# Altium schematic sheet SW6124+A+B+C+内部解密Lighting+LED.SchDoc
size A2; SheetNumber: 0; SheetTotal: 0
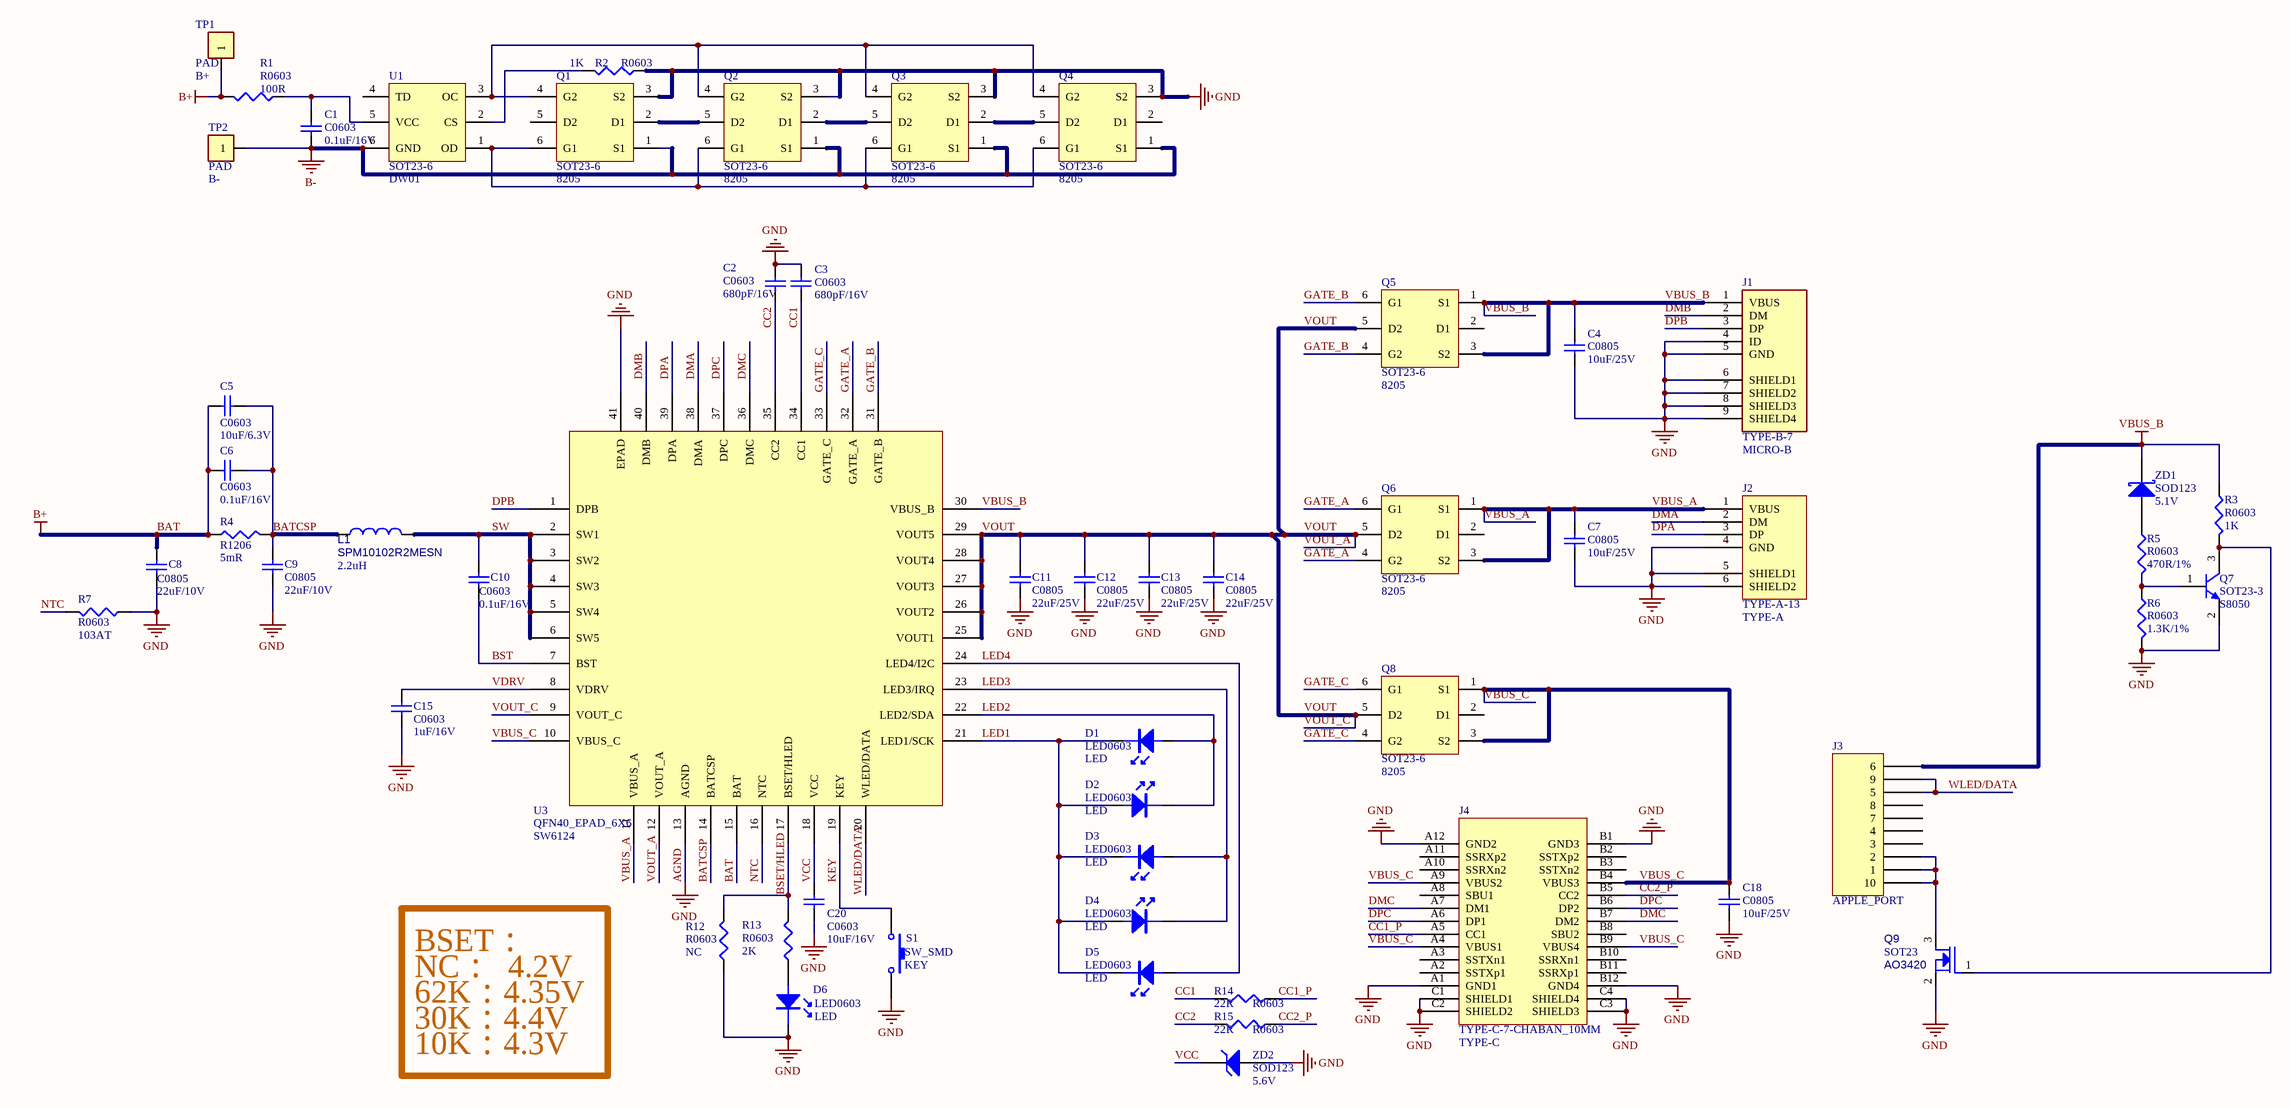
[diagram p0: SW6124+A+B+C+内部解密Lighting+LED.SchDoc]

## Parts
C1  C0603  value 0.1uF/16V  [C0603]
C2  C0603  value 680pF/16V  [C0603]
C3  C0603  value 680pF/16V  [C0603]
C4  C0805  value 10uF/25V  [C0805]
C5  C0603  value 10uF/6.3V  [C0603]
C6  C0603  value 0.1uF/16V  [C0603]
C7  C0805  value 10uF/25V  [C0805]
C8  C0805  value 22uF/10V  [C0805]
C9  C0805  value 22uF/10V  [C0805]
C10  C0603  value 0.1uF/16V  [C0603]
C11  C0805  value 22uF/25V  [C0805]
C12  C0805  value 22uF/25V  [C0805]
C13  C0805  value 22uF/25V  [C0805]
C14  C0805  value 22uF/25V  [C0805]
C15  C0603  value 1uF/16V  [C0603]
C18  C0805  value 10uF/25V  [C0805]
C20  C0603  value 10uF/16V  [C0603]
D1  LED  [LED0603]
D2  LED  [LED0603]
D3  LED  [LED0603]
D4  LED  [LED0603]
D5  LED  [LED0603]
D6  LED  [LED0603]
J1  value MICRO-B  [TYPE-B-7]  (hidden comment: USB_MICRO_B)
J2  value TYPE-A  [TYPE-A-13]  (hidden comment: TYPE-A-1)
J3  APPLE_PORT
J4  TYPE-C  [TYPE-C-7-CHABAN_10MM]
L1  SPM10102R2MESN  value 2.2uH  [INDUCTOR_SPM1010]
Q1  8205  [SOT23-6]
Q2  8205  [SOT23-6]
Q3  8205  [SOT23-6]
Q4  8205  [SOT23-6]
Q5  8205  [SOT23-6]
Q6  8205  [SOT23-6]
Q7  Footprint: SOT23-3  [SOT-23-]  (hidden comment: S8050)
Q8  8205  [SOT23-6]
Q9  AO3420  [SOT23]
R1  R0603  value 100R  [R0603]
R2  R0603  value 1K  [R0603]
R3  R0603  value 1K  [R0603]
R4  R1206  value 5mR  [R1206]
R5  R0603  value 470R/1%  [R0603]
R6  R0603  value 1.3K/1%  [R0603]
R7  R0603  value 103AT  [R0603]
R12  R0603  value NC  [R0603]
R13  R0603  value 2K  [R0603]
R14  R0603  value 22R  [R0603]
R15  R0603  value 22R  [R0603]
S1  KEY  [SW_SMD]
TP1  B+  [PAD]
TP2  B-  [PAD]
U1  DW01  [SOT23-6]
U3  Footprint: QFN40_EPAD_6X6  (hidden comment: SW6124)
ZD1  value 5.1V  Footprint: SOD123  (hidden comment: Diode 11DQ03)
ZD2  SOD123  [SOD-123]

## Nets
AGND: C2.2 C3.2 C4.1 C7.1 C8.1 C9.1 C11.1 C12.1 C13.1 C14.1 C15.1 C18.1 C20.1 D6.2(K) J1.4(ID) J1.5(GND) J1.6(SHIELD1) J1.7(SHIELD2) J1.8(SHIELD3) J1.9(SHIELD4) J2.4(GND) J2.5(SHIELD1) J2.6(SHIELD2) J4.A1(GND1) J4.A12(GND2) J4.B1(GND3) J4.B12(GND4) J4.C1(SHIELD1) J4.C2(SHIELD2) J4.C3(SHIELD3) J4.C4(SHIELD4) Q1.3(S2) Q2.3(S2) Q3.3(S2) Q4.3(S2) Q7.2(E) Q9.2(SOURCE) R2.1 R6.2 R7.1 R12.1 S1.2 U3.13(AGND) U3.41(EPAD) ZD2.1(A)  [also labelled GND]
B-: C1.1 Q1.1(S1) Q2.1(S1) Q3.1(S1) Q4.1(S1) TP2.1 U1.6(GND)
BAT: C5.1 C6.1 C8.2 R1.2 R4.1 TP1.1 U3.15(BAT)  [also labelled B+]
VBUS_B: C4.2 J1.1(VBUS) J3.6 Q5.1(S1) Q5.3(S2) R3.1 U3.30(VBUS_B) ZD1.2(K)
BATCSP: C5.2 C6.2 C9.2 L1.1 R4.2 U3.14(BATCSP)
BSET/HLED: R12.2 R13.2 U3.17(BSET/HLED)
BST: C10.1 U3.7(BST)
CC1: C3.1 R14.2 U3.34(CC1)
CC1_P: J4.A5(CC1) R14.1
CC2: C2.1 R15.2 U3.35(CC2)
CC2_P: J4.B5(CC2) R15.1
DMA: J2.2(DM) U3.38(DMA)
DMB: J1.2(DM) U3.40(DMB)
DMC: J4.A7(DM1) J4.B7(DM2) U3.36(DMC)
DPA: J2.3(DP) U3.39(DPA)
DPB: J1.3(DP) U3.1(DPB)
DPC: J4.A6(DP1) J4.B6(DP2) U3.37(DPC)
GATE_A: Q6.4(G2) Q6.6(G1) U3.32(GATE_A)
GATE_B: Q5.4(G2) Q5.6(G1) U3.31(GATE_B)
GATE_C: Q8.4(G2) Q8.6(G1) U3.33(GATE_C)
KEY: S1.1 U3.19(KEY)
LED1: D1.2(K) D2.1(A) D3.2(K) D4.1(A) D5.2(K) U3.21(LED1/SCK)
LED2: D1.1(A) D2.2(K) U3.22(LED2/SDA)
LED3: D3.1(A) D4.2(K) U3.23(LED3/IRQ)
LED4: D5.1(A) U3.24(LED4/I2C)
NTC: R7.2 U3.16(NTC)
SW: C10.2 L1.2 U3.2(SW1) U3.3(SW2) U3.4(SW3) U3.5(SW4) U3.6(SW5)
VBUS_A: C7.2 J2.1(VBUS) Q6.1(S1) Q6.3(S2) U3.11(VBUS_A)
VBUS_C: C18.2 J4.A4(VBUS1) J4.A9(VBUS2) J4.B4(VBUS3) J4.B9(VBUS4) Q8.1(S1) Q8.3(S2) U3.10(VBUS_C)
VCC: C20.2 U3.18(VCC) ZD2.2(K)
VDRV: C15.2 U3.8(VDRV)
VOUT: C11.2 C12.2 C13.2 C14.2 Q5.5(D2) Q6.5(D2) Q8.5(D2) U3.9(VOUT_C) U3.12(VOUT_A) U3.25(VOUT1) U3.26(VOUT2) U3.27(VOUT3) U3.28(VOUT4) U3.29(VOUT5)  [also labelled VOUT_A, VOUT_C]
WLED/DATA: J3.5 J3.9 U3.20(WLED/DATA)
NetC1_2: C1.2 R1.1 U1.5(VCC)
NetD6_1: D6.1(A) R13.1
NetJ3_1: J3.1 J3.2 J3.10 Q9.3(DRAIN)
NetQ1_2: Q1.2(D1) Q2.5(D2)
NetQ1_4: Q1.4(G2) Q2.4(G2) Q3.4(G2) Q4.4(G2) U1.3(OC)
NetQ1_6: Q1.6(G1) Q2.6(G1) Q3.6(G1) Q4.6(G1) U1.1(OD)
NetQ2_2: Q2.2(D1) Q3.5(D2)
NetQ3_2: Q3.2(D1) Q4.5(D2)
NetQ7_1: Q7.1(B) R5.2 R6.1
NetQ7_3: Q7.3(C) Q9.1(GATE) R3.2
NetR2_2: R2.2 U1.2(CS)
NetR5_1: R5.1 ZD1.1(A)

Not connected (* = marked no-connect by the designer): J3 3 4 7 8; J4 A2(SSTXp1) A3(SSTXn1) A8(SBU1) A10(SSRXn2) A11(SSRXp2) B2(SSTXp2) B3(SSTXn2) B8(SBU2) B10(SSRXn1) B11(SSRXp1); Q1 5(D2); Q4 2(D1); Q5 2(D1); Q6 2(D1); Q8 2(D1); U1 4(TD)

## Notes on the sheet
- BSET：
- NC：  4.2V
- 62K：4.35V
- 30K：4.4V
- 10K：4.3V
- (in symbol D Zener) 5.6V

## Library data of the parts
C1 = Cap: Capacitor; Published: 8-Jun-2000; LatestRevisionDate: 17-Jul-2002; LatestRevisionNote: Re-released for DXP Platform.; PackageReference: RAD-0.3; Publisher: Altium Limited; PackageDescription: Radial Cap, Thru-Hole; 2 Leads; 0.3 in Pin Spacing
C2-C7 C10 C15 C18 C20 = CAP0603: Capacitor; Published: 8-Jun-2000; LatestRevisionDate: 17-Jul-2002; LatestRevisionNote: Re-released for DXP Platform.; PackageReference: RAD-0.3; Publisher: Altium Limited; PackageDescription: Radial Cap, Thru-Hole; 2 Leads; 0.3 in Pin Spacing
C8 C9 C11-C14 = CAP0805: Capacitor; Published: 8-Jun-2000; LatestRevisionDate: 17-Jul-2002; LatestRevisionNote: Re-released for DXP Platform.; PackageReference: RAD-0.3; Publisher: Altium Limited; PackageDescription: Radial Cap, Thru-Hole; 2 Leads; 0.3 in Pin Spacing
D1-D6 = LED: 单?: 0.1; Value: LED
L1 = INDUCTOR
Q1-Q6 Q8 = 8205B: Value: 8205; Footprinf: SOT23-6
Q7 = 2N3904: NPN General Purpose Amplifier; Published: 8-Jun-2000; LatestRevisionDate: 15-Jan-2003; LatestRevisionNote: PCB Footprint 'BCY-W3/D4.7' replaced; DatasheetVersion: 1997; PackageVersion: Sep-1998; PackageReference: TO-92A; Publisher: Altium Limited; PackageDescription: TO, Flat Index; 3 In-Line, Axial Leads; Body Dia. 4.5mm; Leads 0.51 x 0.48 mm (max); ComponentLink1Description: Manufacturer Link; ComponentLink1URL: http://www.fairchildsemi.com/; ComponentLink2Description: Datasheet; ComponentLink2URL: http://www.fairchildsemi.com/ds/2N%2F2N3904.pdf; Value: S8050
Q9 = MOSFET_N
R1-R3 R5 R6 = Res3: Resistor; Published: 8-Jun-2000; LatestRevisionDate: 29-May-2009; LatestRevisionNote: IPC-7351 Footprint Added.; PackageReference: J1-0603; Publisher: Altium Limited; PackageDescription: Chip Resistor
R4 R7 R12-R15 = RES: Resistor; Published: 8-Jun-2000; LatestRevisionDate: 29-May-2009; LatestRevisionNote: IPC-7351 Footprint Added.; PackageReference: J1-0603; Publisher: Altium Limited; PackageDescription: Chip Resistor
S1 = SW K: Value: KEY; Footprinf: SW_SMD
TP1 TP2 = Test Point
  TP1: Value: B+
  TP2: Value: B-
U3 = SW6106_AFC: Value: SW6124
ZD1 = Diode 11DQ03: Schottky Rectifier; Published: 8-Jun-2000; LatestRevisionDate: 17-Jul-2002; LatestRevisionNote: Re-released for DXP Platform.; DatasheetVersion: Dec-1997; PackageReference: DO-204AL; Publisher: Altium Limited; PackageDescription: Diode, Axial; Body 5.2 x 2.7 mm (LxDia. max), Lead Dia. 0.86 mm (max); Code_JEDEC: DO-204-AL; ComponentLink1Description: Manufacturer Link; ComponentLink1URL: http://www.irf.com/; ComponentLink2Description: Datasheet; ComponentLink2URL: http://www.irf.com/product-info/datasheets/data/11dq03.pdf
ZD2 = D Zener: Zener Diode
J1 = USB_MICRO_B: Footprintf: TYPE-B-7
J2 = TYPE-A-1: Footprinf: TYPE-A-13
J3 = APPLE_PORT: Footprint: *; Value: APPLE_PORT
J4 = TYPE-C: Value: TYPE-C
U1 = DW01: Value: DW01; Footprinf: SOT23-6